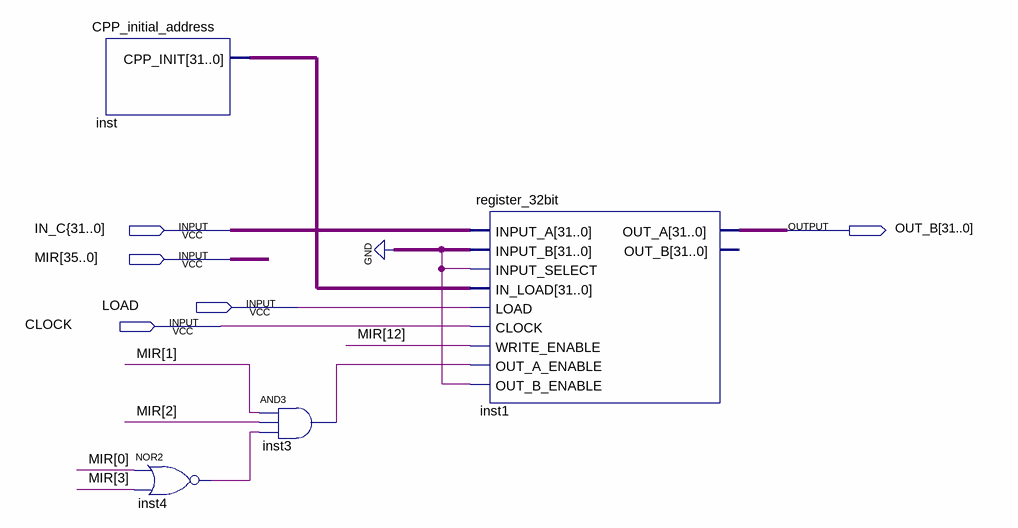
[diagram p0: schematic sheet]
// Quartus schematic CPP.bdf as structural Verilog: 4 symbols, 5 pins
module CPP (
  input  \IN_C{31..0] ,
  input  [35:0] MIR,
  input  LOAD,
  input  CLOCK,
  output [31:0] OUT_B
);

  wire inst3_out, inst4_out, undriven_2;
  wire [31:0] inst_cpp_init, undriven;

  CPP_initial_address inst (.CPP_INIT(inst_cpp_init));
  nor inst4 (inst4_out, MIR[0], MIR[3]);
  and inst3 (inst3_out, MIR[1], MIR[2], inst4_out);
  register_32bit inst1 (
    .INPUT_A(undriven), .INPUT_B({32{1'b0}}), .INPUT_SELECT(undriven_2), .IN_LOAD(inst_cpp_init),
    .LOAD(LOAD), .CLOCK(CLOCK), .WRITE_ENABLE(MIR[12]), .OUT_A_ENABLE(inst3_out), .OUT_B_ENABLE(undriven_2),
    .OUT_A(OUT_B));  // open: OUT_B
endmodule
